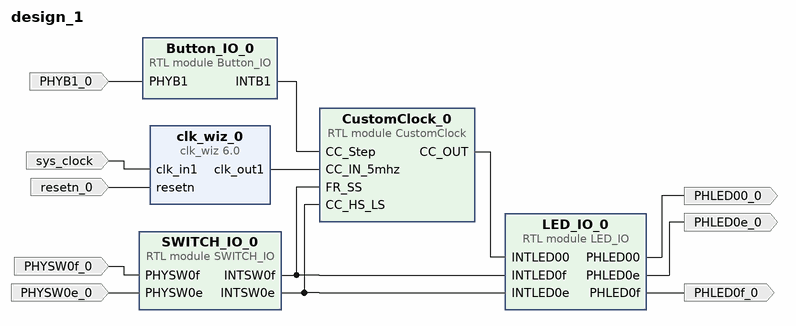
[diagram p0: block diagram of the top level]
# Vivado block design design_1, xc7a100tcsg324-1, Vivado 2019.2
create_bd_design design_1

create_bd_port -dir I -type clk sys_clock
set_property -dict {CONFIG.FREQ_HZ 100000000 CONFIG.PHASE 0.000} [get_bd_ports sys_clock]
create_bd_port -dir I -type rst resetn_0
create_bd_port -dir O PHLED00_0
create_bd_port -dir O PHLED0e_0
create_bd_port -dir O PHLED0f_0
create_bd_port -dir I PHYSW0f_0
create_bd_port -dir I PHYSW0e_0
create_bd_port -dir I PHYB1_0

create_bd_cell -type module -reference LED_IO LED_IO_0
create_bd_cell -type module -reference SWITCH_IO SWITCH_IO_0
create_bd_cell -type ip -vlnv xilinx.com:ip:clk_wiz:6.0 clk_wiz_0
set_property -dict [list \
  CONFIG.CLKOUT1_JITTER 631.442 \
  CONFIG.CLKOUT1_PHASE_ERROR 346.848 \
  CONFIG.CLKOUT1_REQUESTED_OUT_FREQ 5 \
  CONFIG.CLK_IN1_BOARD_INTERFACE sys_clock \
  CONFIG.MMCM_CLKFBOUT_MULT_F 32.000 \
  CONFIG.MMCM_CLKOUT0_DIVIDE_F 128.000 \
  CONFIG.MMCM_DIVCLK_DIVIDE 5 \
  CONFIG.RESET_PORT resetn \
  CONFIG.RESET_TYPE ACTIVE_LOW \
  CONFIG.USE_BOARD_FLOW true \
  CONFIG.USE_LOCKED false \
] [get_bd_cells clk_wiz_0]
create_bd_cell -type module -reference CustomClock CustomClock_0
create_bd_cell -type module -reference Button_IO Button_IO_0

# ---- connections ----

connect_bd_net [get_bd_ports sys_clock] [get_bd_pins clk_wiz_0/clk_in1]
connect_bd_net -net resetn_0_1 [get_bd_ports resetn_0] [get_bd_pins clk_wiz_0/resetn]
connect_bd_net [get_bd_pins clk_wiz_0/clk_out1] [get_bd_pins CustomClock_0/CC_IN_5mhz]
connect_bd_net [get_bd_pins SWITCH_IO_0/INTSW0f] [get_bd_pins CustomClock_0/FR_SS] [get_bd_pins LED_IO_0/INTLED0f]
connect_bd_net [get_bd_pins SWITCH_IO_0/INTSW0e] [get_bd_pins CustomClock_0/CC_HS_LS] [get_bd_pins LED_IO_0/INTLED0e]
connect_bd_net [get_bd_pins CustomClock_0/CC_OUT] [get_bd_pins LED_IO_0/INTLED00]
connect_bd_net [get_bd_pins LED_IO_0/PHLED00] [get_bd_ports PHLED00_0]
connect_bd_net [get_bd_pins LED_IO_0/PHLED0e] [get_bd_ports PHLED0e_0]
connect_bd_net [get_bd_pins LED_IO_0/PHLED0f] [get_bd_ports PHLED0f_0]
connect_bd_net -net PHYSW0f_0_1 [get_bd_ports PHYSW0f_0] [get_bd_pins SWITCH_IO_0/PHYSW0f]
connect_bd_net -net PHYSW0e_0_1 [get_bd_ports PHYSW0e_0] [get_bd_pins SWITCH_IO_0/PHYSW0e]
connect_bd_net -net PHYB1_0_1 [get_bd_ports PHYB1_0] [get_bd_pins Button_IO_0/PHYB1]
connect_bd_net [get_bd_pins Button_IO_0/INTB1] [get_bd_pins CustomClock_0/CC_Step]

validate_bd_design
save_bd_design
